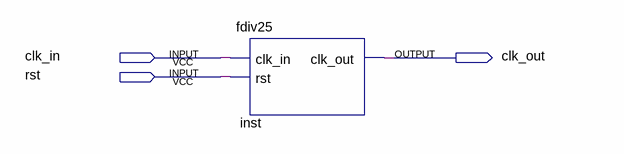
[diagram p0: schematic sheet]
// Quartus schematic divisor.bdf as structural Verilog: 1 symbols, 3 pins
module divisor (
  input  clk_in,
  input  rst,
  output clk_out
);

  fdiv25 inst (.clk_in(clk_in), .rst(rst), .clk_out(clk_out));
endmodule
